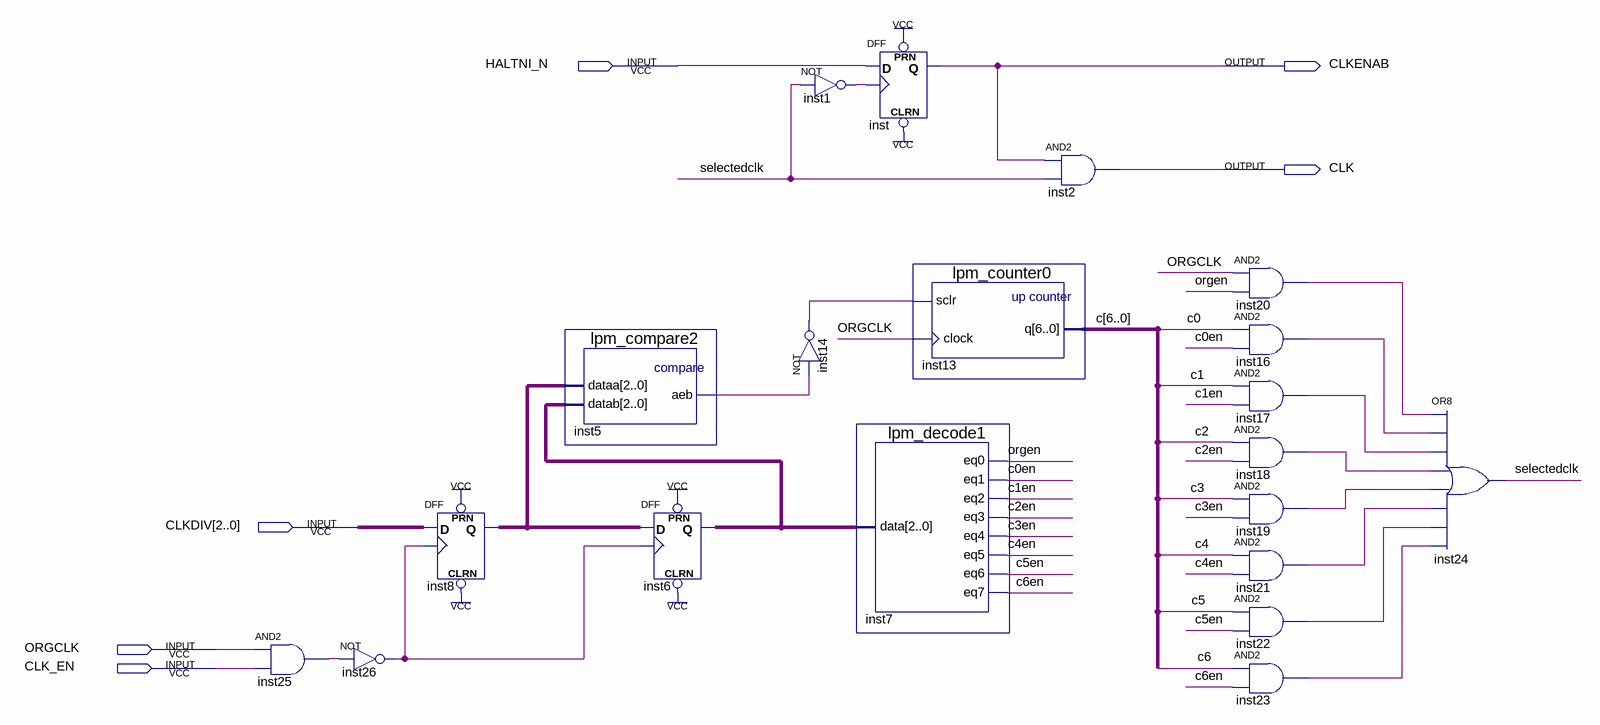
[diagram p0: schematic sheet]
// Quartus schematic clkgen5.bdf as structural Verilog: 20 symbols, 6 pins
module clkgen5 (
  input  HALTNI_N,
  input  [2:0] CLKDIV,
  input  ORGCLK,
  input  CLK_EN,
  output CLKENAB,
  output CLK
);

  wire c0en, c1en, c2en, c3en, c4en, c5en, c6en, inst1_out, inst5_aeb, inst14_out, inst16_out, inst17_out,
       inst18_out, inst19_out, inst20_out, inst21_out, inst22_out, inst23_out, inst25_out, inst26_out, orgen,
       selectedclk;
  wire [2:0] inst6_q, inst8_q;
  wire [6:0] c;

  and inst25 (inst25_out, ORGCLK, CLK_EN);
  not inst26 (inst26_out, inst25_out);
  DFF inst8[2:0] (.CLRN(1'b1), .CLK(inst26_out), .D(CLKDIV), .PRN(1'b1), .Q(inst8_q));
  lpm_compare2 inst5 (.dataa(inst8_q), .datab(inst6_q), .aeb(inst5_aeb));
  DFF inst6[2:0] (.CLRN(1'b1), .CLK(inst26_out), .D(inst8_q), .PRN(1'b1), .Q(inst6_q));
  not inst1 (inst1_out, selectedclk);
  not inst14 (inst14_out, inst5_aeb);
  lpm_decode1 inst7 (
    .data(inst6_q), .eq0(orgen), .eq1(c0en), .eq2(c1en), .eq3(c2en), .eq4(c3en), .eq5(c4en), .eq6(c5en),
    .eq7(c6en));
  DFF inst (.CLRN(1'b1), .CLK(inst1_out), .D(HALTNI_N), .PRN(1'b1), .Q(CLKENAB));
  lpm_counter0 inst13 (.sclr(inst14_out), .clock(ORGCLK), .q(c));
  and inst2 (CLK, CLKENAB, selectedclk);
  and inst20 (inst20_out, ORGCLK, orgen);
  and inst16 (inst16_out, c[0], c0en);
  and inst17 (inst17_out, c[1], c1en);
  and inst18 (inst18_out, c[2], c2en);
  and inst19 (inst19_out, c[3], c3en);
  and inst21 (inst21_out, c[4], c4en);
  and inst22 (inst22_out, c[5], c5en);
  and inst23 (inst23_out, c[6], c6en);
  or inst24 (selectedclk, inst20_out, inst16_out, inst17_out, inst18_out, inst19_out, inst21_out, inst22_out, inst23_out);
endmodule
